# Altium schematic sheet SWITCHES.SchDoc
size D; SheetNumber: 4; SheetTotal: 5
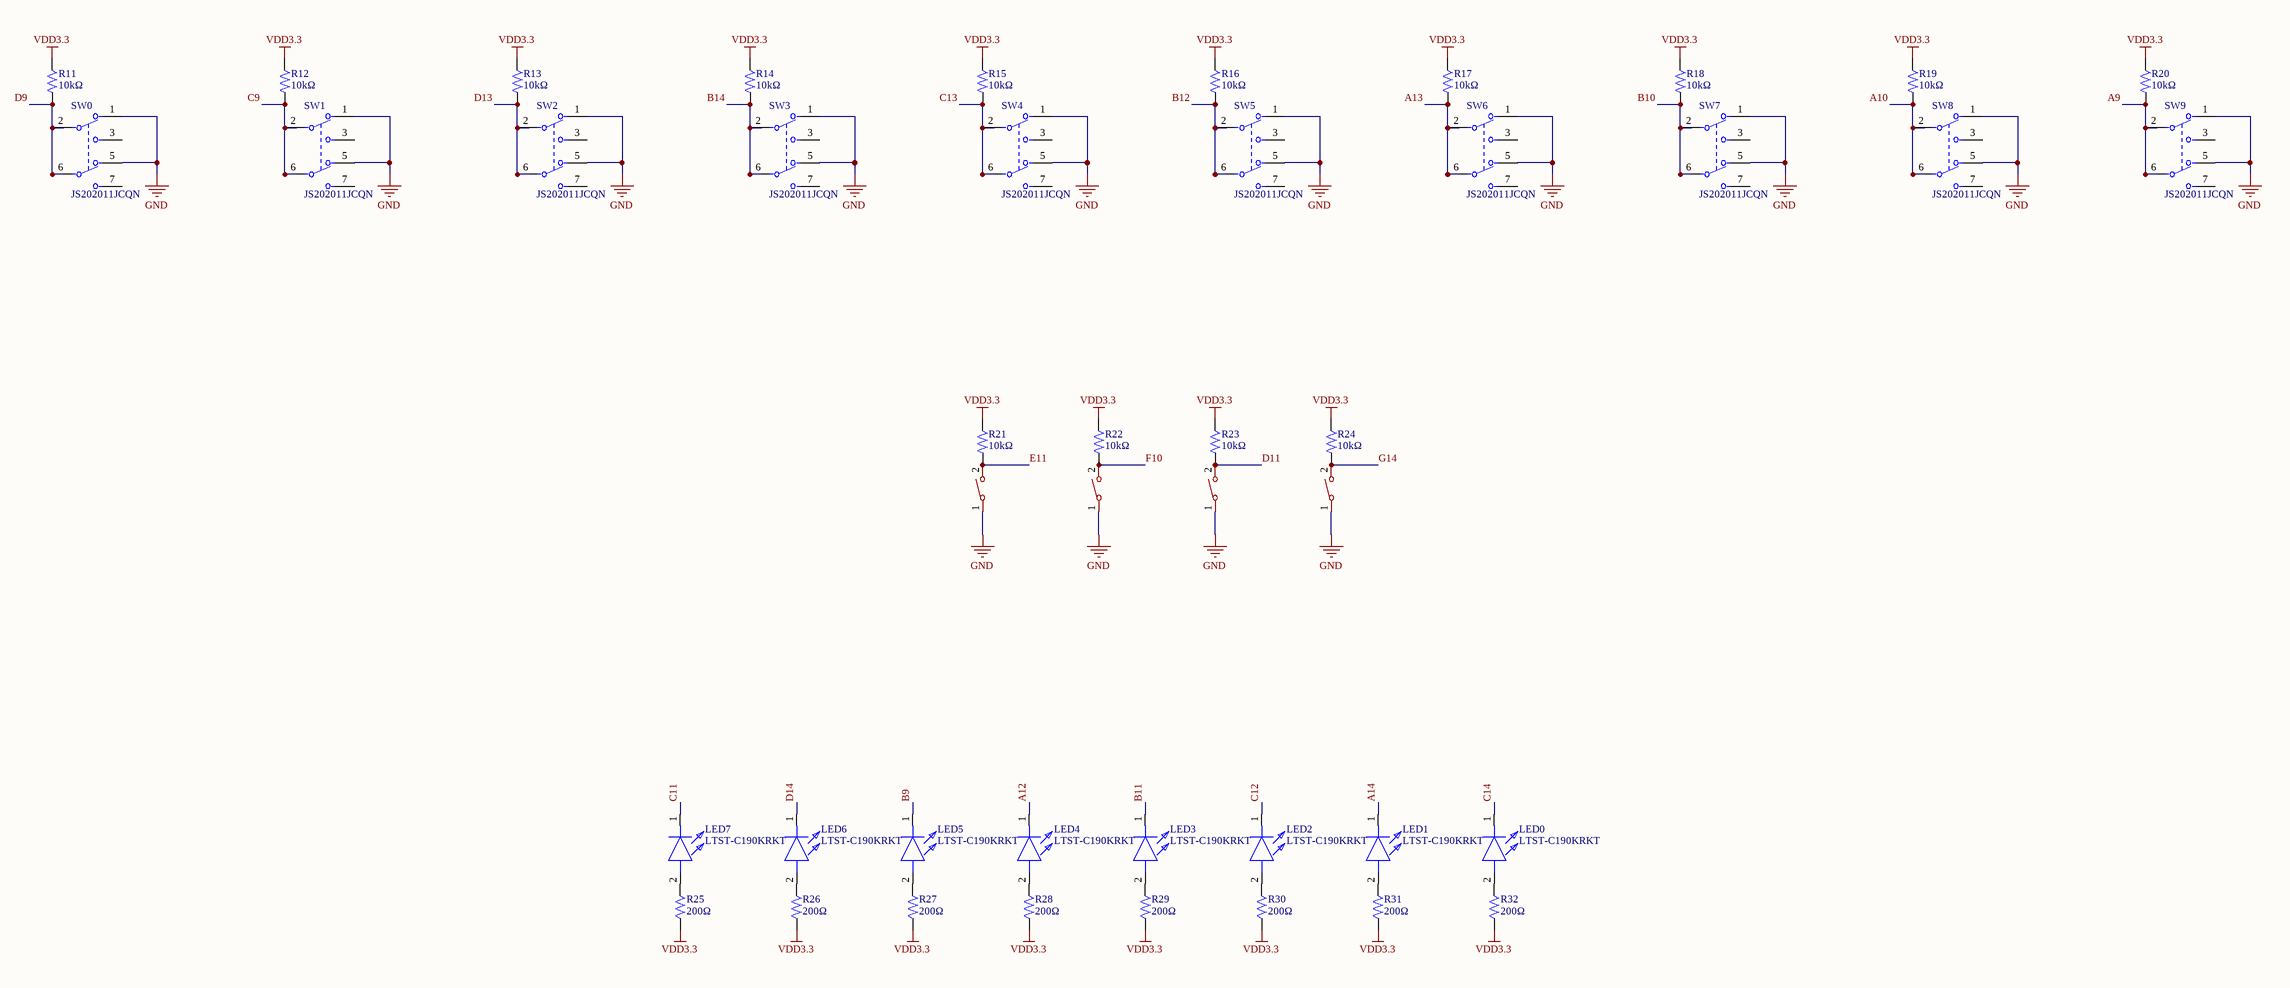
[diagram p0: SWITCHES.SchDoc]

## Parts
LED0  LTST-C190KRKT  [LEDC1608X80N]
LED1  LTST-C190KRKT  [LEDC1608X80N]
LED2  LTST-C190KRKT  [LEDC1608X80N]
LED3  LTST-C190KRKT  [LEDC1608X80N]
LED4  LTST-C190KRKT  [LEDC1608X80N]
LED5  LTST-C190KRKT  [LEDC1608X80N]
LED6  LTST-C190KRKT  [LEDC1608X80N]
LED7  LTST-C190KRKT  [LEDC1608X80N]
R11  Resistance: 10kΩ  [RES-0603]  (hidden comment: 0603WAF1002T5E)
R12  Resistance: 10kΩ  [RES-0603]  (hidden comment: 0603WAF1002T5E)
R13  Resistance: 10kΩ  [RES-0603]  (hidden comment: 0603WAF1002T5E)
R14  Resistance: 10kΩ  [RES-0603]  (hidden comment: 0603WAF1002T5E)
R15  Resistance: 10kΩ  [RES-0603]  (hidden comment: 0603WAF1002T5E)
R16  Resistance: 10kΩ  [RES-0603]  (hidden comment: 0603WAF1002T5E)
R17  Resistance: 10kΩ  [RES-0603]  (hidden comment: 0603WAF1002T5E)
R18  Resistance: 10kΩ  [RES-0603]  (hidden comment: 0603WAF1002T5E)
R19  Resistance: 10kΩ  [RES-0603]  (hidden comment: 0603WAF1002T5E)
R20  Resistance: 10kΩ  [RES-0603]  (hidden comment: 0603WAF1002T5E)
R21  Resistance: 10kΩ  [RES-0603]  (hidden comment: 0603WAF1002T5E)
R22  Resistance: 10kΩ  [RES-0603]  (hidden comment: 0603WAF1002T5E)
R23  Resistance: 10kΩ  [RES-0603]  (hidden comment: 0603WAF1002T5E)
R24  Resistance: 10kΩ  [RES-0603]  (hidden comment: 0603WAF1002T5E)
R25  Resistance: 200Ω  [RES-0402]  (hidden comment: 0402WGF2000TCE)
R26  Resistance: 200Ω  [RES-0402]  (hidden comment: 0402WGF2000TCE)
R27  Resistance: 200Ω  [RES-0402]  (hidden comment: 0402WGF2000TCE)
R28  Resistance: 200Ω  [RES-0402]  (hidden comment: 0402WGF2000TCE)
R29  Resistance: 200Ω  [RES-0402]  (hidden comment: 0402WGF2000TCE)
R30  Resistance: 200Ω  [RES-0402]  (hidden comment: 0402WGF2000TCE)
R31  Resistance: 200Ω  [RES-0402]  (hidden comment: 0402WGF2000TCE)
R32  Resistance: 200Ω  [RES-0402]  (hidden comment: 0402WGF2000TCE)
SW0  JS202011JCQN  [FP-JS202011JCQN-MFG]
SW1  JS202011JCQN  [FP-JS202011JCQN-MFG]
SW2  JS202011JCQN  [FP-JS202011JCQN-MFG]
SW3  JS202011JCQN  [FP-JS202011JCQN-MFG]
SW4  JS202011JCQN  [FP-JS202011JCQN-MFG]
SW5  JS202011JCQN  [FP-JS202011JCQN-MFG]
SW6  JS202011JCQN  [FP-JS202011JCQN-MFG]
SW7  JS202011JCQN  [FP-JS202011JCQN-MFG]
SW8  JS202011JCQN  [FP-JS202011JCQN-MFG]
SW9  JS202011JCQN  [FP-JS202011JCQN-MFG]
SW10  TS-1185-B-A-B-A  [TS-1185-B-A-B-A]  (value not drawn)
SW11  TS-1185-B-A-B-A  [TS-1185-B-A-B-A]  (value not drawn)
SW12  TS-1185-B-A-B-A  [TS-1185-B-A-B-A]  (value not drawn)
SW13  TS-1185-B-A-B-A  [TS-1185-B-A-B-A]  (value not drawn)

## Nets
GND: SW0.1 SW0.5 SW1.1 SW1.5 SW2.1 SW2.5 SW3.1 SW3.5 SW4.1 SW4.5 SW5.1 SW5.5 SW6.1 SW6.5 SW7.1 SW7.5 SW8.1 SW8.5 SW9.1 SW9.5 SW10.1 SW11.1 SW12.1 SW13.1
VDD3.3: R11.2 R12.2 R13.2 R14.2 R15.2 R16.2 R17.2 R18.2 R19.2 R20.2 R21.2 R22.2 R23.2 R24.2 R25.1 R26.1 R27.1 R28.1 R29.1 R30.1 R31.1 R32.1
A9: R20.1 SW9.2(1_C) SW9.6(2_C)
A10: R19.1 SW8.2(1_C) SW8.6(2_C)
A12: LED4.1(K)
A13: R17.1 SW6.2(1_C) SW6.6(2_C)
A14: LED1.1(K)
B9: LED5.1(K)
B10: R18.1 SW7.2(1_C) SW7.6(2_C)
B11: LED3.1(K)
B12: R16.1 SW5.2(1_C) SW5.6(2_C)
B14: R14.1 SW3.2(1_C) SW3.6(2_C)
C9: R12.1 SW1.2(1_C) SW1.6(2_C)
C11: LED7.1(K)
C12: LED2.1(K)
C13: R15.1 SW4.2(1_C) SW4.6(2_C)
C14: LED0.1(K)
D9: R11.1 SW0.2(1_C) SW0.6(2_C)
D11: R23.1 SW12.2
D13: R13.1 SW2.2(1_C) SW2.6(2_C)
D14: LED6.1(K)
E11: R21.1 SW10.2
F10: R22.1 SW11.2
G14: R24.1 SW13.2
NetLED0_2: LED0.2(A) R32.2
NetLED1_2: LED1.2(A) R31.2
NetLED2_2: LED2.2(A) R30.2
NetLED3_2: LED3.2(A) R29.2
NetLED4_2: LED4.2(A) R28.2
NetLED5_2: LED5.2(A) R27.2
NetLED6_2: LED6.2(A) R26.2
NetLED7_2: LED7.2(A) R25.2

Not connected (* = marked no-connect by the designer): SW0 3 7; SW1 3 7; SW2 3 7; SW3 3 7; SW4 3 7; SW5 3 7; SW6 3 7; SW7 3 7; SW8 3 7; SW9 3 7

## Library data of the parts
LED0-LED7 = LTST-C190KRKT: LED; Manufacturer_Name: Lite-On; Datasheet Link: https://componentsearchengine.com/Datasheets/1/LTST-C190KRKT.pdf; Height: 0.8mm; Manufacturer_Part_Number: LTST-C190KRKT; Mouser Part Number: 859-LTST-C190KRKT; Mouser Price/Stock: https://www.mouser.co.uk/ProductDetail/LITEON/LTST-C190KRKT?qs=kAD5fFa1n5VY3YYNWPC1Fg%3D%3D; Arrow Part Number: LTST-C190KRKT; Arrow Price/Stock: https://www.arrow.com/en/products/ltst-c190krkt/lite-on-technology?utm_currency=USD&region=europe
R11-R24 = 0603WAF1002T5E: Resistor, 10kΩ, ±1%, 100mW, 75V, ±100ppm/℃, -55℃~+155℃, SMD 0603; Manufacturer: Uniroyal; Supplier 1: LCSC; Manufacturer Part Number: 0603WAF1002T5E; Supplier Part Number 1: C25804; JLCPCB Part Number: C25804; Power Rating: 100mW; Category: Resistors; Package Size: 0603; JLCPCB Basic Part: Yes; Tolerance: ±1%; Voltage Rating: 75V; Temperature Coefficient: ±100ppm/℃; Temperature Rating: -55℃~+155℃; ComponentLink1Description: Datasheet; ComponentLink1URL: https://wmsc.lcsc.com/wmsc/upload/file/pdf/v2/lcsc/2206010045_UNI-ROYAL-Uniroyal-Elec-0603WAF1002T5E_C25804.pdf; ComponentLink2Description: JLCPCB Part URL; ComponentLink2URL: https://jlcpcb.com/partdetail/C25804
R25-R32 = 0402WGF2000TCE: Resistor, 200Ω, ±1%, 62.5mW, 50V, ±100ppm/℃, -55℃~+155℃, SMD 0402; Manufacturer: Uniroyal; Supplier 1: LCSC; Manufacturer Part Number: 0402WGF2000TCE; Supplier Part Number 1: C25087; JLCPCB Part Number: C25087; Power Rating: 62.5mW; Category: Resistors; Package Size: 0402; JLCPCB Basic Part: Yes; Tolerance: ±1%; Voltage Rating: 50V; Temperature Coefficient: ±100ppm/℃; Temperature Rating: -55℃~+155℃; ComponentLink1Description: Datasheet; ComponentLink1URL: https://wmsc.lcsc.com/wmsc/upload/file/pdf/v2/lcsc/2205311900_UNI-ROYAL-Uniroyal-Elec-0402WGF2000TCE_C25087.pdf; ComponentLink2Description: JLCPCB Part URL; ComponentLink2URL: https://jlcpcb.com/partdetail/C25087
SW0-SW9 = CMP-10038-000009-1: SWITCH SLIDE DPDT 300MA 6V; Actuator Material: Nylon; Actuator Length: 2mm; Actuator Type: Standard; Electrical Life: 5000Cycles; Switch Function: On-On; Mount: Surface Mount; Current Rating: 300mA; Contact Material: Copper Alloy; Voltage Rating (DC): 6V; Throw Configuration: DPDT; Packaging: Cut Tape; Contact Plating: Silver; Min Operating Temperature: -40°C; Switch Travel: 2mm; Max Operating Temperature: 85°C
SW10-SW13 = TS-1185-B-A-B-A: Tactile switch ROHS, SPST Surface Mount, -30C +85C 1.6N 12V 2mm 3mm 4mm 50mA Black no round button; Manufacturer: XKB Connectivity(中国星坤); Add into BOM: yes; Operating Force: 160gf; Strike Gundam: 不带; Mechanical Life: 10万次; Symbol: TS-1185-B-A-B-A; Device: TS-1185-B-A-B-A; LCSC Part Name: 4*3*2mm 立贴 轻触开关; Supplier Part: C561517; Manufacturer Part: TS-1185-B-A-B-A; Supplier Footprint: SMD; JLCPCB Part Class: Extended Part; Datasheet: https://atta.szlcsc.com/upload/public/pdf/source/20211011/C2F26DC0AE1820400F54DBF49644F5A1.pdf; Supplier: LCSC; Convert to PCB: yes; Circuit: SPST; Actuator Style: Round Button; Mounting Style: Brick nogging; Switch Length: 4mm; Switch Width: 3mm; Switch Height: 2mm; Contact Current: 50mA; Voltage Rating (DC): 12V; Insulation Resistance: -; Actuator/Cap Color: Black; With Lamp: No; Operating Temperature: -30℃~+85℃